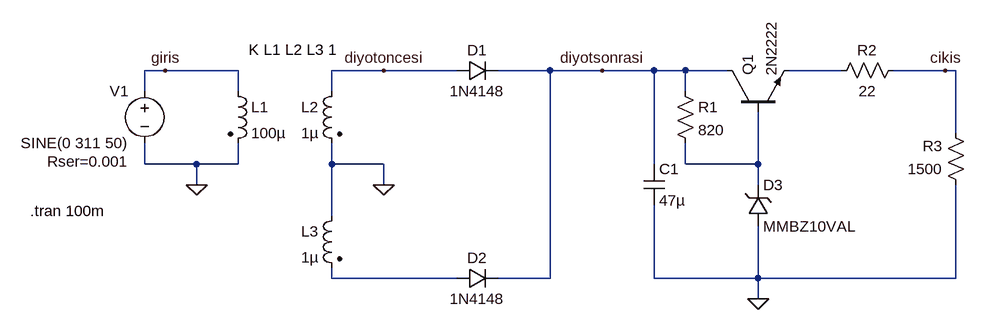
[diagram p0: schematic deney1.asc]
deney1.asc, the LTspice schematic file:
Version 4
SHEET 1 1508 680
WIRE 32 48 0 48
WIRE 144 48 32 48
WIRE 368 48 288 48
WIRE 480 48 368 48
WIRE 624 48 544 48
WIRE 704 48 624 48
WIRE 784 48 704 48
WIRE 832 48 784 48
WIRE 896 48 832 48
WIRE 1072 48 992 48
WIRE 1232 48 1152 48
WIRE 1248 48 1232 48
WIRE 0 80 0 48
WIRE 144 80 144 48
WIRE 288 80 288 48
WIRE 832 80 832 48
WIRE 1248 144 1248 48
WIRE 0 192 0 160
WIRE 80 192 0 192
WIRE 144 192 144 160
WIRE 144 192 80 192
WIRE 288 192 288 160
WIRE 368 192 288 192
WIRE 784 192 784 48
WIRE 832 192 832 160
WIRE 944 192 944 112
WIRE 944 192 832 192
WIRE 80 224 80 192
WIRE 368 224 368 192
WIRE 944 224 944 192
WIRE 288 272 288 192
WIRE 288 368 288 352
WIRE 480 368 288 368
WIRE 624 368 624 48
WIRE 624 368 544 368
WIRE 784 368 784 256
WIRE 944 368 944 288
WIRE 944 368 784 368
WIRE 1248 368 1248 224
WIRE 1248 368 944 368
WIRE 944 400 944 368
FLAG 80 224 0
FLAG 368 224 0
FLAG 368 48 diyotoncesi
FLAG 704 48 diyotsonrasi
FLAG 1232 48 cikis
FLAG 32 48 giris
FLAG 944 400 0
SYMBOL ind2 128 64 R0
SYMATTR InstName L1
SYMATTR Value 100µ
SYMATTR Type ind
SYMBOL ind2 304 64 M0
SYMATTR InstName L2
SYMATTR Value 1µ
SYMATTR Type ind
SYMBOL voltage 0 64 M0
WINDOW 123 0 0 Left 0
WINDOW 39 24 124 Left 2
SYMATTR InstName V1
SYMATTR Value SINE(0 311 50)
SYMATTR SpiceLine Rser=0.001
SYMBOL ind2 304 256 M0
SYMATTR InstName L3
SYMATTR Value 1µ
SYMATTR Type ind
SYMBOL diode 480 64 R270
WINDOW 0 32 32 VTop 2
WINDOW 3 0 32 VBottom 2
SYMATTR InstName D1
SYMATTR Value 1N4148
SYMBOL diode 480 384 R270
WINDOW 0 32 32 VTop 2
WINDOW 3 0 32 VBottom 2
SYMATTR InstName D2
SYMATTR Value 1N4148
SYMBOL npn 896 112 R270
SYMATTR InstName Q1
SYMATTR Value 2N2222
SYMBOL cap 768 192 R0
SYMATTR InstName C1
SYMATTR Value 47µ
SYMBOL res 816 64 R0
SYMATTR InstName R1
SYMATTR Value 820
SYMBOL res 1168 32 R90
WINDOW 0 0 56 VBottom 2
WINDOW 3 32 56 VTop 2
SYMATTR InstName R2
SYMATTR Value 22
SYMBOL res 1264 240 R180
WINDOW 0 36 76 Left 2
WINDOW 3 36 40 Left 2
SYMATTR InstName R3
SYMATTR Value 1500
SYMBOL zener 928 288 M180
WINDOW 0 24 64 Left 2
WINDOW 3 24 0 Left 2
SYMATTR InstName D3
SYMATTR Value MMBZ10VAL
TEXT 160 16 Left 2 !K L1 L2 L3 1
TEXT -176 264 Left 2 !.tran 100m

The netlist it stands for:
* deney1.asc
L1 giris 0 100µ
L2 diyotoncesi 0 1µ
V1 giris 0 SINE(0 311 50) Rser=0.001
L3 0 N003 1µ
D1 diyotoncesi diyotsonrasi 1N4148
D2 N003 diyotsonrasi 1N4148
Q1 diyotsonrasi N002 N001 0 2N2222
C1 diyotsonrasi 0 47µ
R1 diyotsonrasi N002 820
R2 cikis N001 22
R3 0 cikis 1500
D3 0 N002 MMBZ10VAL
.model D D
.lib standard.dio
.model NPN NPN
.model PNP PNP
.lib standard.bjt
K L1 L2 L3 1
.tran 100m
.backanno
.end